# EAGLE design ep-pannel (EAGLE 5.07)
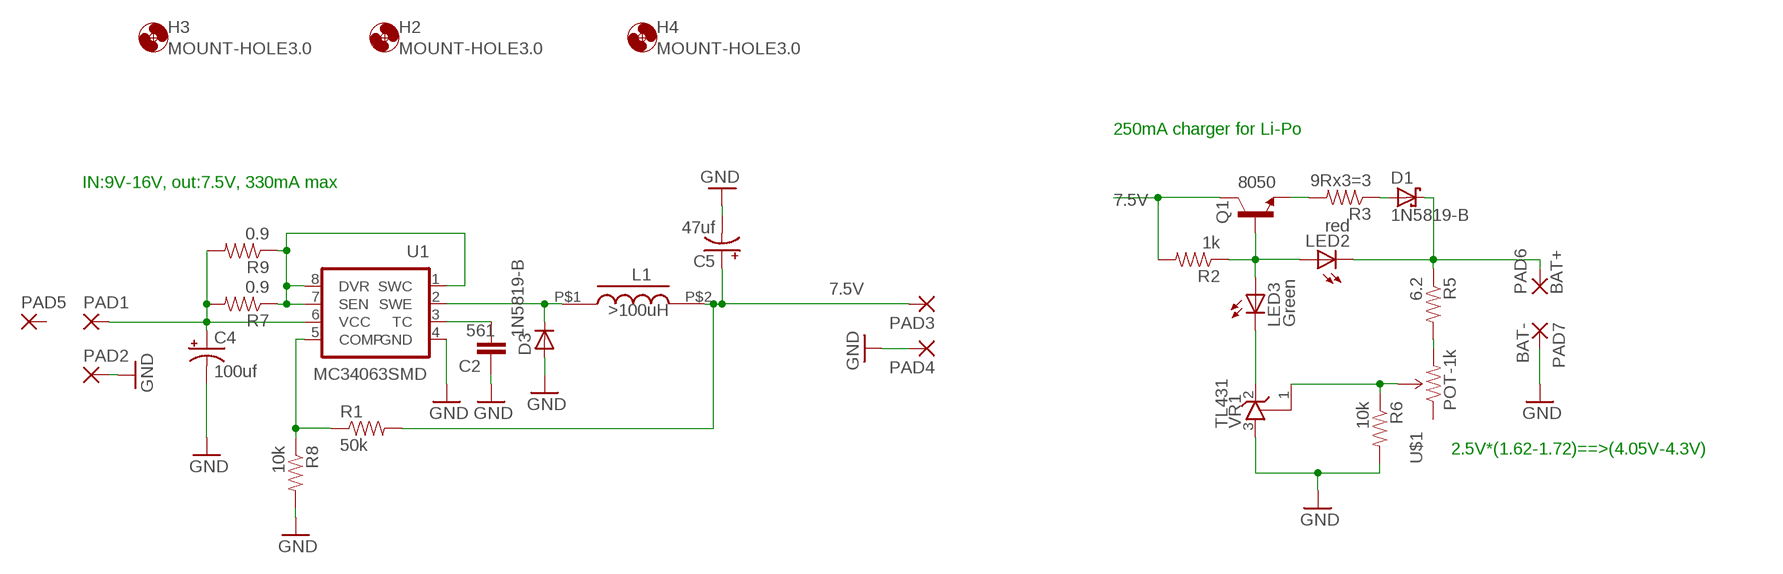
[diagram p0: schematic, sheet 1]

## Parts
C2  561  CAP0805  [0805]
C4  100uf  CAP_POL7343  [EIA7343]
C5  47uf  CAP_POL7343  [EIA7343]
D1  1N5819-B  1N581-SMA  [SMA-DIODE]
D3  1N5819-B  DIODESMA  [SMA-DIODE]
H2  MOUNT-HOLE3.0  [3,0]
H3  MOUNT-HOLE3.0  [3,0]
H4  MOUNT-HOLE3.0  [3,0]
L1  >100uH  INDUCTOR-I-CD75  [CD75]
LED2  red  LED3MM  [LED3MM]
LED3  Green  LED3MM  [LED3MM]
PAD1  SMD5  [SMD2,54-5,08]
PAD2  SMD5  [SMD2,54-5,08]
PAD3  SMD5  [SMD2,54-5,08]
PAD4  SMD5  [SMD2,54-5,08]
PAD5  SMD5  [SMD2,54-5,08]
PAD6  BAT+  WIREPAD3,17/1,1  [3,17/1,1]
PAD7  BAT-  WIREPAD3,17/1,1  [3,17/1,1]
Q1  8050  -NPN-SOT23-BEC  [SOT23-BEC]
R1  50k  RESISTOR0805  [0805]
R2  1k  RESISTOR0805  [0805]
R3  9Rx3=3  RESISTOR0805  [0805]
R5  6.2  RESISTOR0805  [0805]
R6  10k  RESISTOR0805  [0805]
R7  0.9  RESISTOR0805  [0805]
R8  10k  RESISTOR0805  [0805]
R9  0.9  RESISTOR0805  [0805]
U1  MC34063SMD  [SO08]
U$1  POT-1k  TRIMPOTPTH  [TRIM_POT_PTH]
VR1  TL431  TL431-SOT-23-RCA  [SOT23]

## Nets
7.5V: C5.A(+) L1.P$2 PAD3.1(P) Q1.C R1.2 R2.2
GND: C2.1 C4.C(-) C5.C(-) D3.A PAD2.1(P) PAD4.1(P) PAD7.1(P) R6.2 R8.2 U1.4(GND) VR1.3(A)
N$1: C2.2 U1.3(TC)
N$2: C4.A(+) PAD1.1(P) R7.2 R9.2 U1.6(VCC)
N$3: R1.1 R8.1 U1.5(COMP)
N$4: LED2.A LED3.A Q1.B R2.1
N$6: D3.C L1.P$1 U1.2(SWE)
N$8: R7.1 R9.1 U1.1(SWC) U1.7(SEN) U1.8(DVR)
N$9: D1.C LED2.K(C) PAD6.1(P) R5.1
N$10: R6.1 U$1.2(WIPER) VR1.1(R)
N$11: Q1.E R3.2
N$12: LED3.K(C) VR1.2(C)
N$14: R5.2 U$1.3(CW)
N$15: D1.A R3.1
Unconnected: PAD5.1(P) U$1.1(CCW)

## Notes on the sheet
- 250mA charger for Li-Po
- IN:9V-16V, out:7.5V, 330mA max
- 2.5V*(1.62-1.72)==>(4.05V-4.3V)

## Library data of the parts
C2 = SparkFun:CAP: Capacitor Standard 0603 ceramic capacitor, and 0.1" leaded capacitor.
C4 C5 = SparkFun:CAP_POL: Capacitor Polarized These are standard SMD and PTH capacitors. Normally 10uF, 47uF, and 100uF in electrolytic and tantalum varieties. Always verify the external diameter of the through hole cap, it varies with capacity, voltage, and manufacturer. The EIA devices should be standard.
D1 = digital-toy:1N581*: 1.0A SCHOTTKY BARRIER RECTIFIER Source: http://www.diodes.com/datasheets/ds23001.pdf
D3 = digital-toy:DIODE: Diode These are standard reverse protection diodes and small signal diodes. SMA package can handle up to about 1A. SOD-323 can handle about 200mA. What the SOD-323 package when ordering, there are some mfgs out there that are 5-pin packages.
H2-H4 = holes:MOUNT-HOLE: MOUNTING HOLE with drill center marker
L1 = digital-toy:INDUCTOR-I: Inductors with Iron
LED2 LED3 = digital-toy:LED: LEDs Standard schematic elements and footprints for 5mm, 3mm, 1206, and 0603 sized LEDs. 5mm - Spark Fun Electronics SKU : COM-00529 (and others) copy led.lbr 0805 led here, by hyl digital-toy. 2010.6.29
PAD1-PAD5 = wirepad:SMD5: SMD PAD
PAD6 PAD7 = wirepad:WIREPAD: Wire PAD connect wire on PCB
Q1 = digital-toy:*-NPN-: NPN Transistror most of sot-23 use the pacages sot23-BEC, top C, left B, right E. by hyl, digital-toy. and to-92 use ebc(from-top) by hyl, digital-toy.
R1-R3 R5-R9 = digital-toy:RESISTOR: Resistor Basic schematic elements and footprints for 0603, 1206, and PTH 1/10th watt (small) resistors. digital-toy copy vertical mount of axial-0.3 from rcl.lbr : the 0207/xx
U1 = digital-toy:MC34063: digital toy dip8-l smd
U$1 = SparkFun:TRIMPOT
VR1 = digital-toy:TL431-: VOLTAGE REGULATOR add sot-23 RCA/CRA packages , by DIgital-toy 2011.6.6

## Board
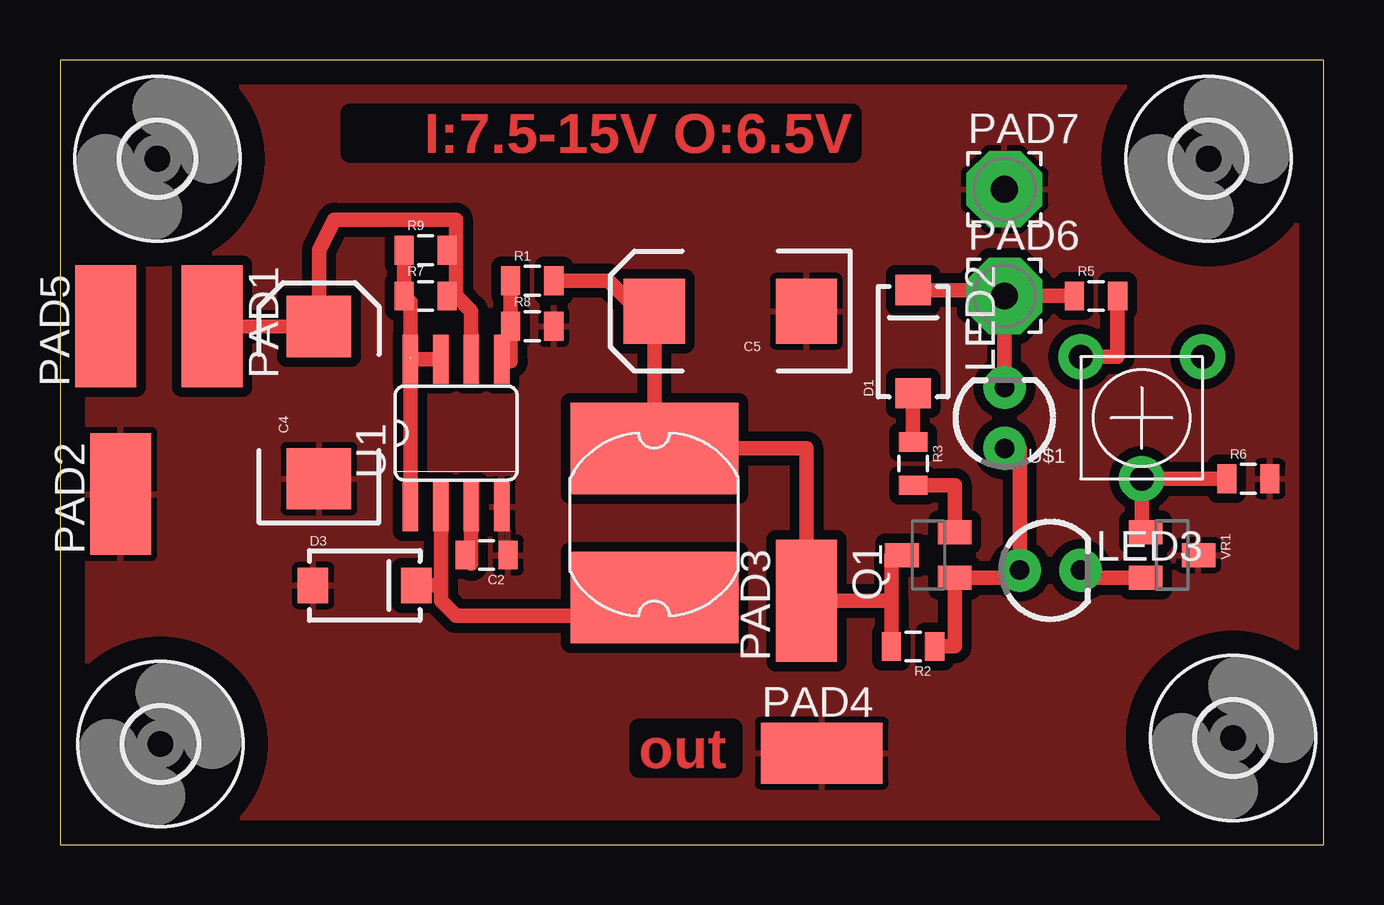
[diagram p1: board, top side]

Size 52.69 x 32.69 mm. Coordinates in mm from the lower left corner, seen from the top.
Outline: 0,0 52.69,0 52.69,32.69 0,32.69 0,0
Copper layers (1*16): Top 0.035mm / dielectric 1.5mm / Bottom 0.035mm
Design rules "default": minimum track width 10mil, minimum drill 24mil, track to track 8mil, track to pad 8mil, pad to pad 8mil, via to via 8mil, smd to smd 8mil, copper to edge 40mil, drill to drill 8mil, minimum pad ring 10mil, minimum via ring 8mil, stop-mask expansion 4mil, vias tented up to drill 0mil, thermal gap 10mil

### Footprints (pad centres in the part's own frame; a part is rotated, then mirrored left to right if it is on the bottom)
0805 = smd 0.8 x 1.2: 1 -0.9,0; 2 0.9,0
EIA7343 = smd 2.55 x 2.7: A 3.17,0; C -3.17,0
SMA-DIODE = smd 1.27 x 1.47: A -2.15,0; C 2.15,0
3,0 = hole 3: 0,0
CD75 = smd 3.81 x 7: P$1 -3.042,-0.006; P$2 3.173,-0.006
LED3MM = drill 0.813 pad 1.778 round: A -1.27,0; K 1.27,0
SMD2,54-5,08 = smd 2.54 x 5.08: 1 0,0
3,17/1,1 = drill 1.118 pad 3.175 octagon: 1 0,0
SOT23-BEC = smd 1 x 1.4: B -0.95,-1.1; C 0,1.1; E 0.95,-1.1
SO08 = smd 0.66 x 2.032: 1 -1.905,-3.073; 2 -0.635,-3.073; 3 0.635,-3.073; 4 1.905,-3.073; 5 1.905,3.073; 6 0.635,3.073; 7 -0.635,3.073; 8 -1.905,3.073
TRIM_POT_PTH = drill 1 pad 1.88 round: 1 -2.54,-2.54; 2 0,2.54; 3 2.54,-2.54
SOT23 = smd 1 x 1.4: 1 -0.95,-1.1; 2 0.95,-1.1; 3 0,1.1

### Placement (x,y rotation side)
C2  17.78,12.06 180 top
C4  10.79,18.41 90 top
C5  27.94,22.23 180 top
D1  35.56,20.95 90 top
D3  12.7,10.79 0 top
H1  MOUNT-HOLE3.0  [3,0]  47.88,28.57 0 top
H2  48.9,4.45 0 top
H3  4.06,28.57 0 top
H4  4.19,4.19 0 top
L1  24.77,13.34 90 top
LED2  39.37,17.78 90 top
LED3  41.27,11.43 0 top
PAD1  6.35,21.59 180 top
PAD2  2.54,14.61 0 top
PAD3  31.11,10.16 0 top
PAD4  31.75,3.81 270 top
PAD5  1.91,21.59 0 top
PAD6  39.37,22.86 0 top
PAD7  39.37,27.3 0 top
Q1  36.2,12.06 90 top
R1  19.68,23.5 0 top
R2  35.56,8.26 180 top
R3  35.56,15.88 270 top
R5  43.18,22.86 0 top
R6  49.53,15.24 0 top
R7  15.24,22.86 0 top
R8  19.68,21.59 0 top
R9  15.24,24.77 0 top
U1  16.51,17.14 0 top
U$1  45.09,17.78 180 top
VR1  46.35,12.06 270 top

### Tracks (layer width: path | path; a pad name or v marks a point on that pad's centre or on a via)
7.5V
  Top 0.254: 24.13,22.23 C5.A
  Top 0.61: R1.2 22.86,23.5 24.13,22.23 | C5.A L1.P$2 31.11,16.51 PAD3.1 34.66,10.16 | Q1.C 34.66,12.06 34.66,10.16 | 34.66,10.16 R2.2
GND
  pour Top (isolate 0.406): -1.91,45.72 84.45,45.72 93.34,36.83 93.34,2.54 81.92,-8.89 3.81,-8.89 -4.45,-1.27 -4.45,40.01
N$1
  Top 0.254: C2.2 17.14,11.7
  Top 0.61: 17.14,11.7 U1.3
N$2
  Top 0.254: 16.51,22.86 R7.2
  Top 0.61: PAD1.1 C4.A 10.79,24.77 11.43,26.04 16.51,26.04 16.51,24.77 | 16.51,24.77 16.51,22.86 17.14,22.23 U1.6 | 16.51,24.77 R9.2
N$3
  Top 0.61: R1.1 R8.1 18.79,20.13 U1.5
N$4
  Top 0.61: R2.1 37.3,8.26 Q1.B 40.01,11.12 LED3.A 40.01,16.51 LED2.A
N$6
  Top 0.61: D3.C 15.88,10.79 | 15.88,10.79 U1.2 | L1.P$1 22.73,9.53 16.51,9.53 15.88,10.16 15.88,10.79
N$8  (1 unrouted)
  Top 0.61: U1.7 U1.8 U1.1 | 14.61,20.32 14.61,22.59 R7.1 R9.1
N$9
  Top 0.61: PAD6.1 R5.1 | D1.C 39.37,23.11 PAD6.1 | LED2.K PAD6.1
N$10
  Top 0.61: VR1.1 45.09,13.19 U$1.2 R6.1
N$11
  Top 0.61: R3.2 37.3,14.97 Q1.E
N$12
  Top 0.61: LED3.K 42.86,11.12 VR1.2
N$14
  Top 0.61: U$1.3 44.08,20.32 R5.2
N$15
  Top 0.61: R3.1 D1.A

### Text on the board
Top: I:7.5-15V O:6.5V | out